# Altium project neurophys_audio_amplifier.PrjPcb
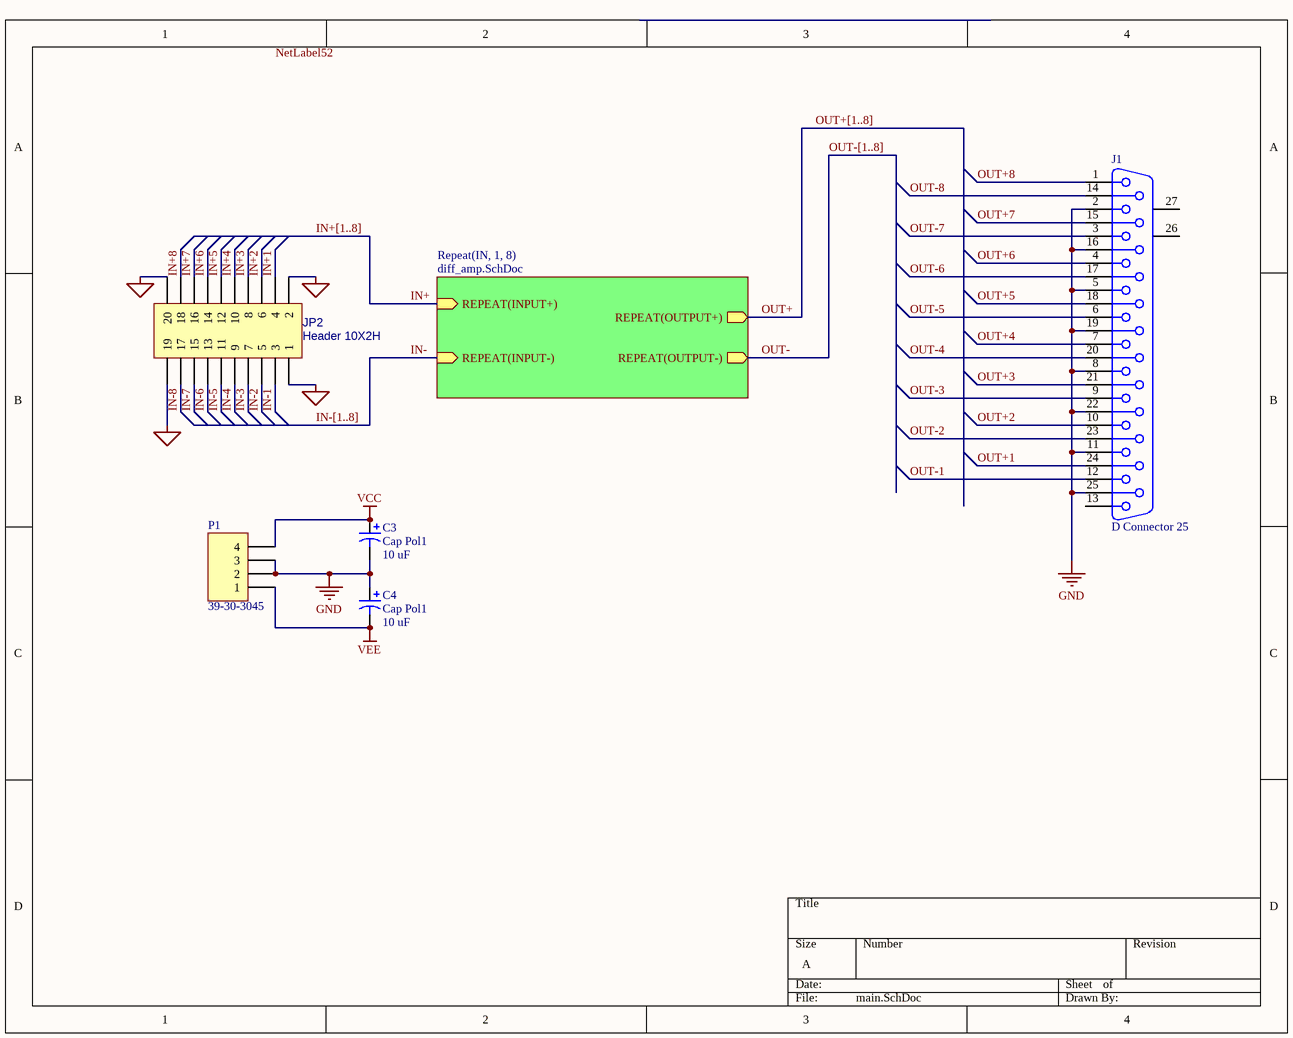
[diagram p0: main.SchDoc]
2 sheets, 117 parts. Net scope: hierarchical (ports join the sheet entries above them; power ports are global).
Board file: main.PcbDoc
Sheets:
  main.SchDoc
    IN1 = diff_amp.SchDoc
    IN2 = diff_amp.SchDoc
    IN3 = diff_amp.SchDoc
    IN4 = diff_amp.SchDoc
    IN5 = diff_amp.SchDoc
    IN6 = diff_amp.SchDoc
    IN7 = diff_amp.SchDoc
    IN8 = diff_amp.SchDoc

## Sheet main.SchDoc
size A

### Parts
C3  Cap Pol1  value 10 uF  [CAPPR5-5x5]
C4  Cap Pol1  value 10 uF  [CAPPR5-5x5]
J1  D Connector 25  [DSUB1.385-2H25A]
JP2  Header 10X2H  [HDR2X10]
P1  39-30-3045  [MJ4RTHR]

### Sub-sheets
Repeat(IN, 1, 8) = diff_amp.SchDoc: REPEAT(INPUT+) (in), REPEAT(INPUT-) (in), REPEAT(OUTPUT+) (out), REPEAT(OUTPUT-) (out)

### Nets
AGND: JP2.1 JP2.2 JP2.19 JP2.20
GND: C3.2 C4.1 J1.2 J1.5 J1.8 J1.11 J1.16 J1.19 J1.22 J1.25 P1.2 P1.3
VCC: C3.1 P1.4
VEE: C4.2 P1.1
IN+: sheet Repeat(IN, 1, 8)/REPEAT(INPUT+)
IN+1: JP2.4
IN+2: JP2.6
IN+3: JP2.8
IN+4: JP2.10
IN+5: JP2.12
IN+6: JP2.14
IN+7: JP2.16
IN+8: JP2.18
IN-: sheet Repeat(IN, 1, 8)/REPEAT(INPUT-)
IN-1: JP2.3
IN-2: JP2.5
IN-3: JP2.7
IN-4: JP2.9
IN-5: JP2.11
IN-6: JP2.13
IN-7: JP2.15
IN-8: JP2.17
OUT+: sheet Repeat(IN, 1, 8)/REPEAT(OUTPUT+)
OUT+1: J1.24
OUT+2: J1.10
OUT+3: J1.21
OUT+4: J1.7
OUT+5: J1.18
OUT+6: J1.4
OUT+7: J1.15
OUT+8: J1.1
OUT-: sheet Repeat(IN, 1, 8)/REPEAT(OUTPUT-)
OUT-1: J1.12
OUT-2: J1.23
OUT-3: J1.9
OUT-4: J1.20
OUT-5: J1.6
OUT-6: J1.17
OUT-7: J1.3
OUT-8: J1.14

Not connected (* = marked no-connect by the designer): J1 13 26(MH1) 27(MH2)

### Buses and harness runs
bus IN+[1..8]
bus IN-[1..8]
bus OUT+[1..8]
bus OUT-[1..8]

### Notes on the sheet
- Labels drawn without touching a wire or pin: NetLabel52

### Library data of the parts
C3 C4 = Cap Pol1: Polarized Capacitor (Radial); Published: 8-Jun-2000; LatestRevisionDate: 17-Jul-2002; LatestRevisionNote: Re-released for DXP Platform.; PackageReference: RB7.6-15; Publisher: Altium Limited
J1 = D Connector 25: Receptacle Assembly, 25 Position, Right Angle; PackageDocument: U; Positions: 25; Published: 15-Jun-2001; LatestRevisionDate: 17-Jul-2002; LatestRevisionNote: Re-released for DXP Platform.; DatasheetDocument: 19-Mar-1999; PackageReference: 787202; Publisher: Altium Limited; Orientation: Right Angle; Gender: Receptacle
JP2 = Header 10X2H: Header, 10-Pin, Dual row, Right Angle; Manufacturer: Generic Components; Class I: Connector; Revision: July-2002: Re-released for DXP Platform.; Publisher: Altium Limited
P1 = Header 4: Header, 4-Pin; LatestRevisionDate: 17-Jul-2002; LatestRevisionNote: Re-released for DXP Platform.; Publisher: Altium Limited

## Sheet diff_amp.SchDoc
size A
Used 8 times, as channels IN1, IN2, IN3, IN4, IN5, IN6, IN7, IN8. Parts and nets are listed once, with the designators drawn on the sheet.
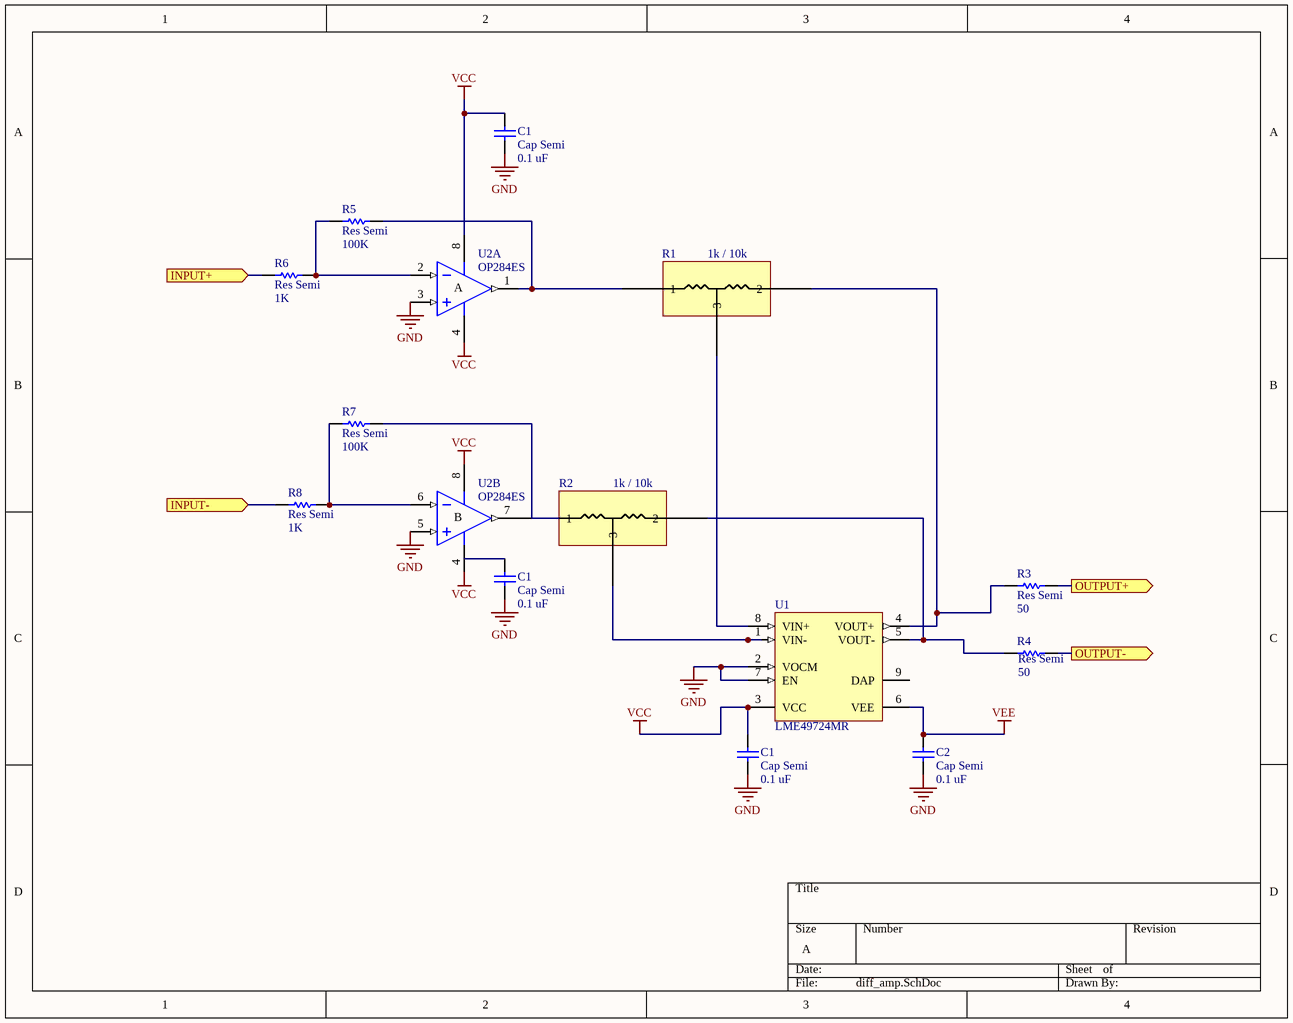
[diagram p1: diff_amp.SchDoc]

### Parts
(Parts that share a designator on the sheet are numbered #1, #2 ... from top to bottom, then left to right.)
C1#1  Cap Semi  value 0.1 uF  [CAPC1608L]
C1#2  Cap Semi  value 0.1 uF  [CAPC1608L]
C1#3  Cap Semi  value 0.1 uF  [CAPC1608L]
C2  Cap Semi  value 0.1 uF  [CAPC1608L]
R1  1k / 10k  [SOT23-3L]
R2  1k / 10k  [SOT23-3L]
R3  Res Semi  value 50  [RESC1608L]
R4  Res Semi  value 50  [RESC1608L]
R5  Res Semi  value 100K  [RESC1608L]
R6  Res Semi  value 1K  [RESC1608L]
R7  Res Semi  value 100K  [RESC1608L]
R8  Res Semi  value 1K  [RESC1608L]
U1  LME49724MR  [MRA08B_M]
U2  OP284ES  [SO-8_M]  (parts A,B of 2)

### Ports
INPUT+ (in), INPUT- (in), OUTPUT+ (out), OUTPUT- (out)

### Nets
GND: C1#1.1 C1#2.1 C1#3.1 C2.1 U1.2(VOCM) U1.7(EN) U2.3(IN+) U2.5(IN+)
VCC: C1#1.2 C1#3.2 U1.3(VCC) U2.4(V-) U2.8(V+)
VEE: C2.2 U1.6(VEE)
INPUT+: R6.1 ; port INPUT+
INPUT-: R8.1 ; port INPUT-
OUTPUT+: R3.2 ; port OUTPUT+
OUTPUT-: R4.2 ; port OUTPUT-
NetR1_0: R1.0(1) R5.2 U2.1(OUT)
NetR1_1: R1.1(2) R3.1 U1.4(VOUT+)
NetR1_2: R1.2(3) U1.8(VIN+)
NetR2_0: R2.0(1) U2.7(OUT)
NetR2_1: R2.1(2) R4.1 U1.5(VOUT-)
NetR2_2: R2.2(3) U1.1(VIN-)
NetR5_1: R5.1 R6.2 U2.2(IN-)
NetR7_1: R7.1 R8.2 U2.6(IN-)

Not connected (* = marked no-connect by the designer): C1#2 2; R7 2; U1 9(DAP)

### Channels
IN1: designators C1=C1_IN1#3 C1=C1_IN1#2 C1=C1_IN1#1 C2=C2_IN1 R1=R1_IN1 R2=R2_IN1 R3=R3_IN1 R4=R4_IN1 R5=R5_IN1 R6=R6_IN1 R7=R7_IN1 R8=R8_IN1 U1=U1_IN1 U2=U2_IN1; ports INPUT+=IN+1 INPUT-=IN-1 OUTPUT+=OUT+1 OUTPUT-=OUT-1
IN2: designators C1=C1_IN2#3 C1=C1_IN2#2 C1=C1_IN2#1 C2=C2_IN2 R1=R1_IN2 R2=R2_IN2 R3=R3_IN2 R4=R4_IN2 R5=R5_IN2 R6=R6_IN2 R7=R7_IN2 R8=R8_IN2 U1=U1_IN2 U2=U2_IN2; ports INPUT+=IN+2 INPUT-=IN-2 OUTPUT+=OUT+2 OUTPUT-=OUT-2
IN3: designators C1=C1_IN3#3 C1=C1_IN3#2 C1=C1_IN3#1 C2=C2_IN3 R1=R1_IN3 R2=R2_IN3 R3=R3_IN3 R4=R4_IN3 R5=R5_IN3 R6=R6_IN3 R7=R7_IN3 R8=R8_IN3 U1=U1_IN3 U2=U2_IN3; ports INPUT+=IN+3 INPUT-=IN-3 OUTPUT+=OUT+3 OUTPUT-=OUT-3
IN4: designators C1=C1_IN4#3 C1=C1_IN4#2 C1=C1_IN4#1 C2=C2_IN4 R1=R1_IN4 R2=R2_IN4 R3=R3_IN4 R4=R4_IN4 R5=R5_IN4 R6=R6_IN4 R7=R7_IN4 R8=R8_IN4 U1=U1_IN4 U2=U2_IN4; ports INPUT+=IN+4 INPUT-=IN-4 OUTPUT+=OUT+4 OUTPUT-=OUT-4
IN5: designators C1=C1_IN5#3 C1=C1_IN5#2 C1=C1_IN5#1 C2=C2_IN5 R1=R1_IN5 R2=R2_IN5 R3=R3_IN5 R4=R4_IN5 R5=R5_IN5 R6=R6_IN5 R7=R7_IN5 R8=R8_IN5 U1=U1_IN5 U2=U2_IN5; ports INPUT+=IN+5 INPUT-=IN-5 OUTPUT+=OUT+5 OUTPUT-=OUT-5
IN6: designators C1=C1_IN6#3 C1=C1_IN6#2 C1=C1_IN6#1 C2=C2_IN6 R1=R1_IN6 R2=R2_IN6 R3=R3_IN6 R4=R4_IN6 R5=R5_IN6 R6=R6_IN6 R7=R7_IN6 R8=R8_IN6 U1=U1_IN6 U2=U2_IN6; ports INPUT+=IN+6 INPUT-=IN-6 OUTPUT+=OUT+6 OUTPUT-=OUT-6
IN7: designators C1=C1_IN7#3 C1=C1_IN7#2 C1=C1_IN7#1 C2=C2_IN7 R1=R1_IN7 R2=R2_IN7 R3=R3_IN7 R4=R4_IN7 R5=R5_IN7 R6=R6_IN7 R7=R7_IN7 R8=R8_IN7 U1=U1_IN7 U2=U2_IN7; ports INPUT+=IN+7 INPUT-=IN-7 OUTPUT+=OUT+7 OUTPUT-=OUT-7
IN8: designators C1=C1_IN8#3 C1=C1_IN8#2 C1=C1_IN8#1 C2=C2_IN8 R1=R1_IN8 R2=R2_IN8 R3=R3_IN8 R4=R4_IN8 R5=R5_IN8 R6=R6_IN8 R7=R7_IN8 R8=R8_IN8 U1=U1_IN8 U2=U2_IN8; ports INPUT+=IN+8 INPUT-=IN-8 OUTPUT+=OUT+8 OUTPUT-=OUT-8

### Notes on the sheet
- (in symbol OP284ES, part A) A
- (in symbol OP284ES, part B) B

### Library data of the parts
C1#1-C1#3 C2 = Cap Semi: Capacitor (Semiconductor SIM Model); Published: 8-Jun-2000; LatestRevisionDate: 29-May-2009; LatestRevisionNote: IPC-7351 Footprint Added.; PackageReference: C1206; Publisher: Altium Limited; PackageDescription: Chip Capacitor
R1 R2 = resistor_divider: Precision Resistor Divider; pin to pad: 0>1 1>2 2>3
R3-R8 = Res Semi: Semiconductor Resistor; Published: 8-Jun-2000; LatestRevisionDate: 17-Jul-2002; LatestRevisionNote: Re-released for DXP Platform.; PackageReference: AXIAL-0.5; Publisher: Altium Limited
U1 = LME49724MR: High Performance, High Fidelity, Fully-Differential Audio Operational Amplifier; Manufacturer: National Semiconductor; CompType: Audio IC; PackageTopMarking: NSXYTT*L49724*MR; PowerWise: N; Published: 29-May-2009; DatasheetVersion: Nov-2008; PackageVersion: revB, Dec-2007; PackageReference: MRA08B; Publisher: Altium Limited; PackageDescription: Molded, PSOP .193 x .154 x .058in, 8 Lead, .050in Pitch, Large DAP; PartNumber: LME49724MR; RoHS: Y; PinCount: 8; DigiKeyPartNumber: LME49724MR-ND; Code_JEDEC: MS-012-AA; ComponentLink1Description: LME49724 Datasheet; ComponentLink1URL: http://www.national.com/ds/LM/LME49724.pdf; ComponentLink2Description: LME49724 Web Page; ComponentLink2URL: http://www.national.com/pf/LM/LME49724.html; ComponentLink3Description: MRA08B Package Page; ComponentLink3URL: http://www.national.com/packaging/folders/mra08b.html
U2 = OP284ES: Precision Rail-to-Rail Input and Output Operational Amplifier; Published: 8-Jun-2000; LatestRevisionDate: 13-Apr-2006; LatestRevisionNote: IPC-7351 Footprint Added.; DatasheetVersion: REV. 0 1996; PackageVersion: revA; PackageReference: SO-8; Publisher: Altium Limited; PackageDescription: 8-Pin Small Outline Integrated Circuit 1.27 mm Pitch; Code_JEDEC: MS-012-AA; Code_IPC: SOIC127P600-8; ComponentLink1Description: Manufacturer Link; ComponentLink1URL: http://www.analog.com/en/prod/0,,759_786_OP184%2C00.html; ComponentLink2Description: Datasheet; ComponentLink2URL: http://www.analog.com/UploadedFiles/Data_Sheets/390492658OP184_284_484_b.pdf; ComponentLink3Description: Discontinuation Notice; ComponentLink3URL: http://www.analog.com/UploadedFiles/Aerospace_Information/505817548385948813507767505obsolete.pdf

## Nets that join several sheets
GND: main (12 pins), IN1 (8 pins), IN2 (8 pins), IN3 (8 pins), IN4 (8 pins), IN5 (8 pins), IN6 (8 pins), IN7 (8 pins), IN8 (8 pins)
VCC: main (C3.1 P1.4), IN1 (5 pins), IN2 (5 pins), IN3 (5 pins), IN4 (5 pins), IN5 (5 pins), IN6 (5 pins), IN7 (5 pins), IN8 (5 pins)
VEE: main (C4.2 P1.1), IN1 (C2_IN1.2 U1_IN1.6), IN2 (C2_IN2.2 U1_IN2.6), IN3 (C2_IN3.2 U1_IN3.6), IN4 (C2_IN4.2 U1_IN4.6), IN5 (C2_IN5.2 U1_IN5.6), IN6 (C2_IN6.2 U1_IN6.6), IN7 (C2_IN7.2 U1_IN7.6), IN8 (C2_IN8.2 U1_IN8.6)
IN+1: main (JP2.4), IN1 (R6_IN1.1)
IN+2: main (JP2.6), IN2 (R6_IN2.1)
IN+3: main (JP2.8), IN3 (R6_IN3.1)
IN+4: main (JP2.10), IN4 (R6_IN4.1)
IN+5: main (JP2.12), IN5 (R6_IN5.1)
IN+6: main (JP2.14), IN6 (R6_IN6.1)
IN+7: main (JP2.16), IN7 (R6_IN7.1)
IN+8: main (JP2.18), IN8 (R6_IN8.1)
IN-1: main (JP2.3), IN1 (R8_IN1.1)
IN-2: main (JP2.5), IN2 (R8_IN2.1)
IN-3: main (JP2.7), IN3 (R8_IN3.1)
IN-4: main (JP2.9), IN4 (R8_IN4.1)
IN-5: main (JP2.11), IN5 (R8_IN5.1)
IN-6: main (JP2.13), IN6 (R8_IN6.1)
IN-7: main (JP2.15), IN7 (R8_IN7.1)
IN-8: main (JP2.17), IN8 (R8_IN8.1)
OUT+1: main (J1.24), IN1 (R3_IN1.2)
OUT+2: main (J1.10), IN2 (R3_IN2.2)
OUT+3: main (J1.21), IN3 (R3_IN3.2)
OUT+4: main (J1.7), IN4 (R3_IN4.2)
OUT+5: main (J1.18), IN5 (R3_IN5.2)
OUT+6: main (J1.4), IN6 (R3_IN6.2)
OUT+7: main (J1.15), IN7 (R3_IN7.2)
OUT+8: main (J1.1), IN8 (R3_IN8.2)
OUT-1: main (J1.12), IN1 (R4_IN1.2)
OUT-2: main (J1.23), IN2 (R4_IN2.2)
OUT-3: main (J1.9), IN3 (R4_IN3.2)
OUT-4: main (J1.20), IN4 (R4_IN4.2)
OUT-5: main (J1.6), IN5 (R4_IN5.2)
OUT-6: main (J1.17), IN6 (R4_IN6.2)
OUT-7: main (J1.3), IN7 (R4_IN7.2)
OUT-8: main (J1.14), IN8 (R4_IN8.2)